# Altium project Orion_TLM_TTeC.PrjPcb
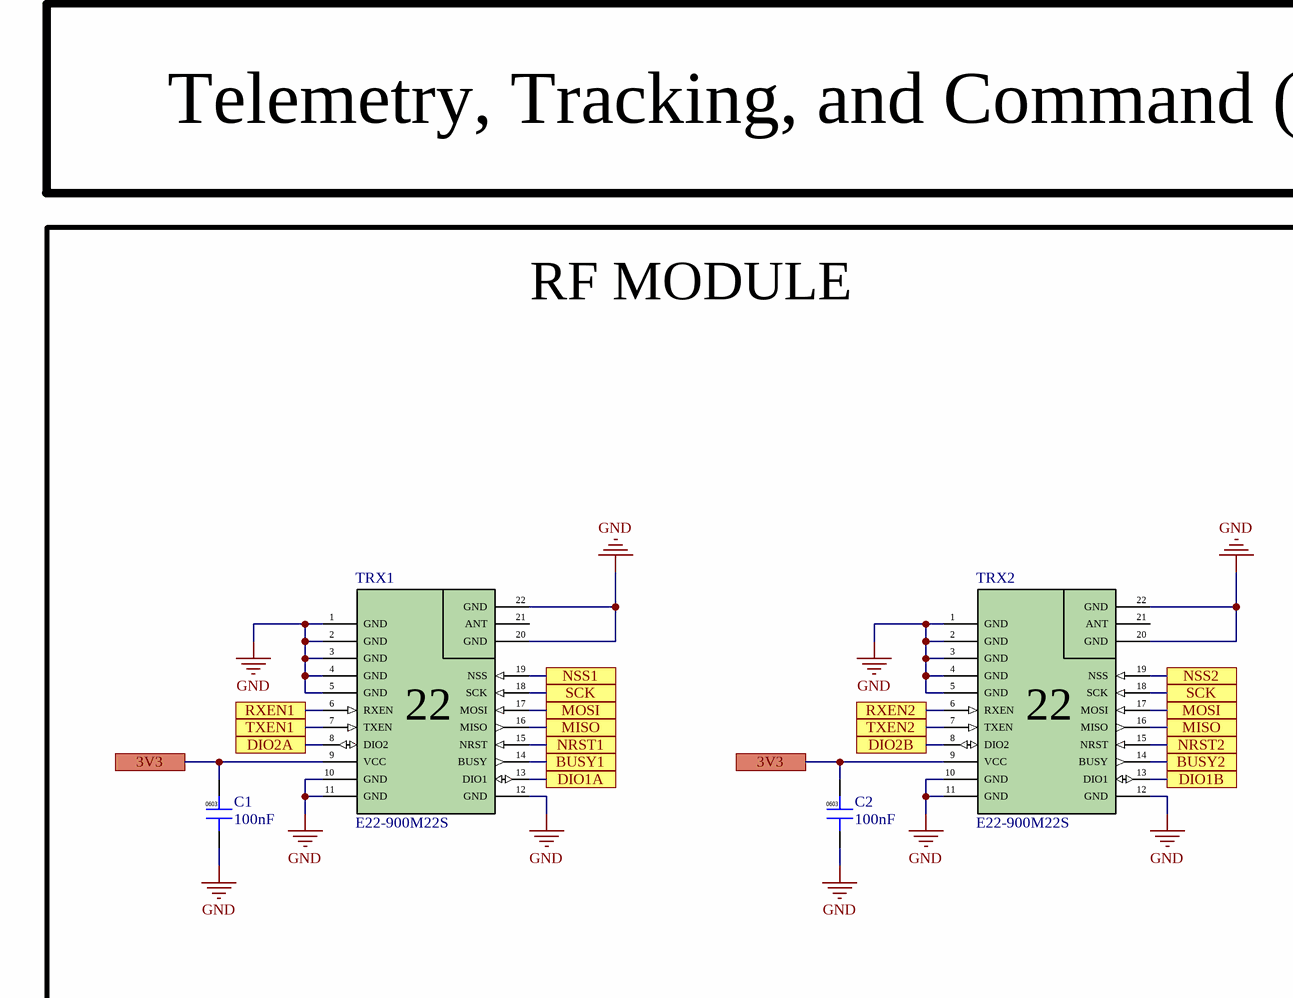
[diagram p0: TTeC_Sheet1.SchDoc, left]
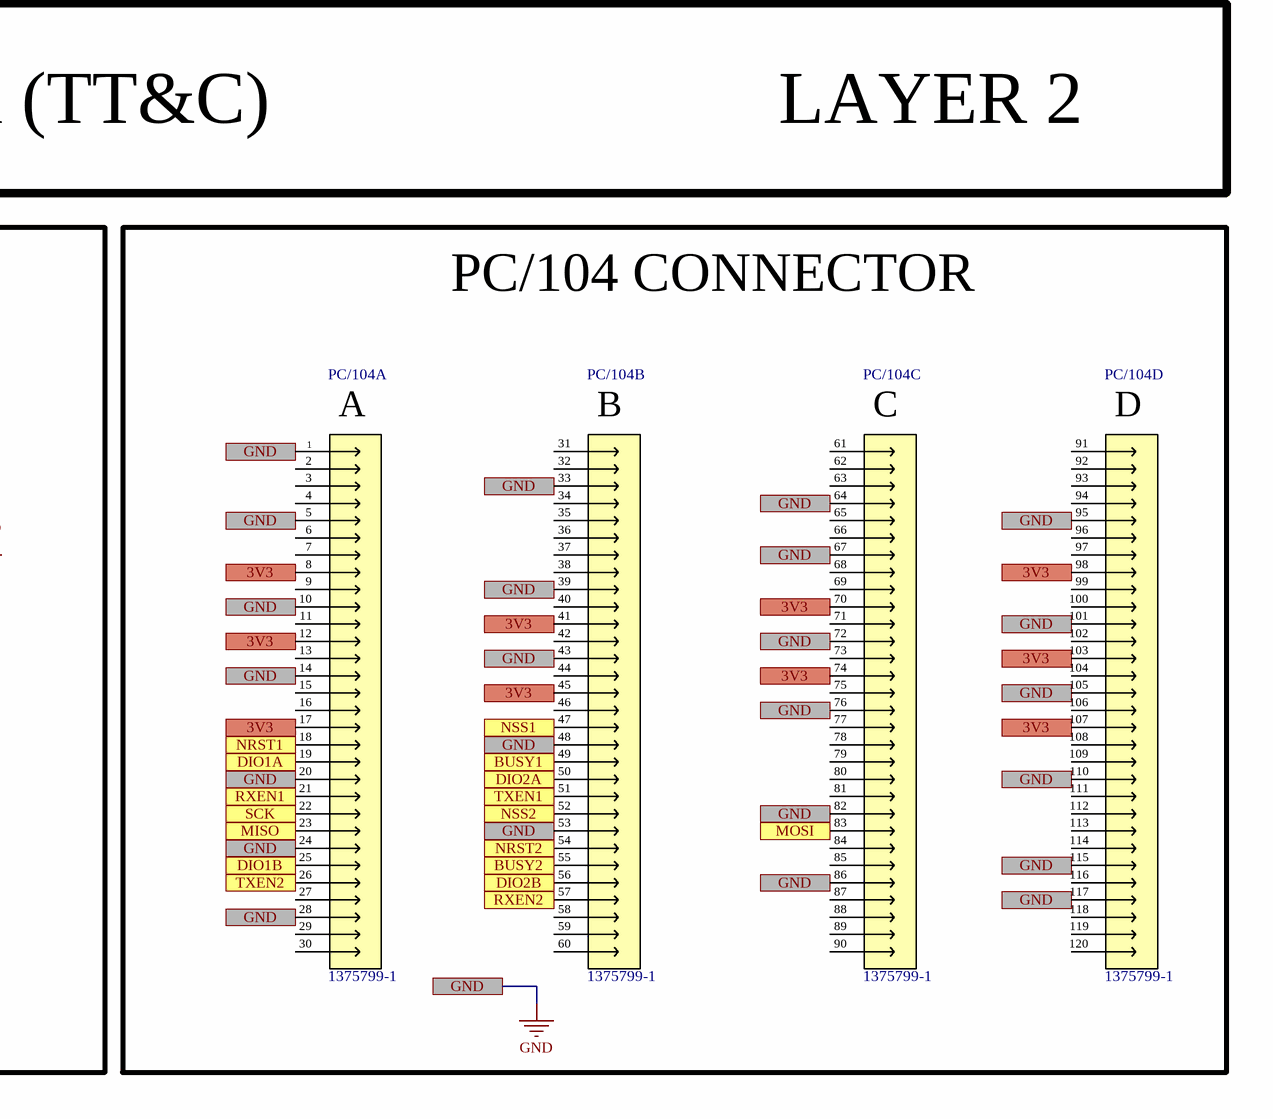
[diagram p1: TTeC_Sheet1.SchDoc, right]
1 sheet, 5 parts. Net scope: flat (ports and power ports of the same name join across sheets).
Board file: TTeC_PCB2.PcbDoc

## Sheet TTeC_Sheet1.SchDoc
size A3; SheetNumber: 1; SheetTotal: 1

### Parts
C1  100nF  [CAP0603_060]
C2  100nF  [CAP0603_060]
PC/104  1375799-1  [1375799-1]  (parts A,B,C,D of 4)
TRX1  E22-900M22S  [E22-900M22S]
TRX2  E22-900M22S  [E22-900M22S]

### Blocks framed on the sheet
RF MODULE: C1 C2 TRX1 TRX2
PC/104 CONNECTOR: PC/104

### Ports
3V3, BUSY1, BUSY2, DIO1A, DIO1B, DIO2A, DIO2B, GND, MISO, MOSI, NRST1, NRST2, NSS1, NSS2, RXEN1, RXEN2, SCK, TXEN1, TXEN2

### Nets
GND: C1.2 C2.2 PC/104.1 PC/104.5 PC/104.10 PC/104.14 PC/104.20 PC/104.24 PC/104.28 PC/104.33 PC/104.39 PC/104.43 PC/104.48 PC/104.53 PC/104.64 PC/104.67 PC/104.72 PC/104.76 PC/104.82 PC/104.86 PC/104.95 PC/104.101 PC/104.105 PC/104.110 PC/104.115 PC/104.117 TRX1.1(GND) TRX1.2(GND) TRX1.3(GND) TRX1.4(GND) TRX1.5(GND) TRX1.10(GND) TRX1.11(GND) TRX1.12(GND) TRX1.20(GND) TRX1.22(GND) TRX2.1(GND) TRX2.2(GND) TRX2.3(GND) TRX2.4(GND) TRX2.5(GND) TRX2.10(GND) TRX2.11(GND) TRX2.12(GND) TRX2.20(GND) TRX2.22(GND) ; port GND
NetC1_1: C1.1 C2.1 PC/104.8 PC/104.12 PC/104.17 PC/104.41 PC/104.45 PC/104.70 PC/104.74 PC/104.98 PC/104.103 PC/104.107 TRX1.9(VCC) TRX2.9(VCC) ; port 3V3
NetPC/104_18: PC/104.18 TRX1.15(NRST) ; port NRST1
NetPC/104_19: PC/104.19 TRX1.13(DIO1) ; port DIO1A
NetPC/104_21: PC/104.21 TRX1.6(RXEN) ; port RXEN1
NetPC/104_22: PC/104.22 TRX1.18(SCK) TRX2.18(SCK) ; port SCK
NetPC/104_23: PC/104.23 TRX1.16(MISO) TRX2.16(MISO) ; port MISO
NetPC/104_25: PC/104.25 TRX2.13(DIO1) ; port DIO1B
NetPC/104_26: PC/104.26 TRX2.7(TXEN) ; port TXEN2
NetPC/104_47: PC/104.47 TRX1.19(NSS) ; port NSS1
NetPC/104_49: PC/104.49 TRX1.14(BUSY) ; port BUSY1
NetPC/104_50: PC/104.50 TRX1.8(DIO2) ; port DIO2A
NetPC/104_51: PC/104.51 TRX1.7(TXEN) ; port TXEN1
NetPC/104_52: PC/104.52 TRX2.19(NSS) ; port NSS2
NetPC/104_54: PC/104.54 TRX2.15(NRST) ; port NRST2
NetPC/104_55: PC/104.55 TRX2.14(BUSY) ; port BUSY2
NetPC/104_56: PC/104.56 TRX2.8(DIO2) ; port DIO2B
NetPC/104_57: PC/104.57 TRX2.6(RXEN) ; port RXEN2
NetPC/104_83: PC/104.83 TRX1.17(MOSI) TRX2.17(MOSI) ; port MOSI

Not connected (* = marked no-connect by the designer): PC/104 2 3 4 6 7 9 11 13 15 16 27 29 30 31 32 34 35 36 37 38 40 42 44 46 58 59 60 61 62 63 65 66 68 69 71 73 75 77 78 79 80 81 84 85 87 88 89 90 91 92 93 94 96 97 99 100 102 104 106 108 109 111 112 113 114 116 118 119 120; TRX1 21(ANT); TRX2 21(ANT)

### Notes on the sheet
- Telemetry, Tracking, and Command (TT&C)
- LAYER 2
- (in symbol 1375799-1, part A) A
- (in symbol 1375799-1, part B) B
- (in symbol 1375799-1, part C) C
- (in symbol 1375799-1, part D) D
- (in symbol CAP0603) 0603

### Library data of the parts
C1 C2 = CAP0603: Capacitor SDM 0603
PC/104 = 1375799-1: AMPMODU PC/104, PC/104 Connectors, Board-to-Board, 120 Position, 2mm [.079in] Centerline, Printed Circuit Board, 3A Contact Current Rating (Max)
TRX1 TRX2 = E22-900M22S: Transreceptor RF 900MHz. / Comunicação: SPI. / Tensão: 3.3V. / Potência: 22dBm. / LoRa, GFSK. / SMD /